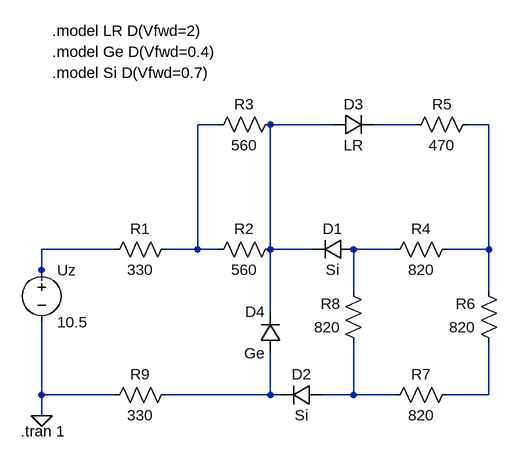
[diagram p0: schematic MajchrowskiMateusz.asc]
MajchrowskiMateusz.asc, the LTspice schematic file:
Version 4
SHEET 1 880 680
WIRE 144 -128 112 -128
WIRE 320 -128 224 -128
WIRE 448 -128 384 -128
WIRE 560 -128 528 -128
WIRE -16 64 -128 64
WIRE 112 64 112 -128
WIRE 112 64 64 64
WIRE 144 64 112 64
WIRE 224 64 224 -128
WIRE 288 64 224 64
WIRE 416 64 352 64
WIRE 560 64 560 -128
WIRE 560 64 496 64
WIRE -128 96 -128 64
WIRE -128 112 -128 96
WIRE 352 128 352 64
WIRE 560 128 560 64
WIRE 224 160 224 64
WIRE -128 288 -128 176
WIRE -16 288 -128 288
WIRE 224 288 224 224
WIRE 224 288 64 288
WIRE 240 288 224 288
WIRE 352 288 352 208
WIRE 352 288 304 288
WIRE 416 288 352 288
WIRE 560 288 560 208
WIRE 560 288 496 288
WIRE -128 320 -128 288
FLAG -128 320 0
SYMBOL voltage -128 80 R0
WINDOW 123 0 0 Left 2
WINDOW 39 0 0 Left 2
SYMATTR InstName Uz
SYMATTR Value 10.5
SYMBOL res 80 272 R90
WINDOW 0 0 56 VBottom 2
WINDOW 3 32 56 VTop 2
SYMATTR InstName R9
SYMATTR Value 330
SYMBOL res 368 224 R180
WINDOW 0 36 76 Left 2
WINDOW 3 36 40 Left 2
SYMATTR InstName R8
SYMATTR Value 820
SYMBOL res 576 224 R180
WINDOW 0 36 76 Left 2
WINDOW 3 36 40 Left 2
SYMATTR InstName R6
SYMATTR Value 820
SYMBOL res 512 272 R90
WINDOW 0 0 56 VBottom 2
WINDOW 3 32 56 VTop 2
SYMATTR InstName R7
SYMATTR Value 820
SYMBOL res 80 48 R90
WINDOW 0 0 56 VBottom 2
WINDOW 3 32 56 VTop 2
SYMATTR InstName R1
SYMATTR Value 330
SYMBOL res 240 48 R90
WINDOW 0 0 56 VBottom 2
WINDOW 3 32 56 VTop 2
SYMATTR InstName R2
SYMATTR Value 560
SYMBOL res 240 -144 R90
WINDOW 0 0 56 VBottom 2
WINDOW 3 32 56 VTop 2
SYMATTR InstName R3
SYMATTR Value 560
SYMBOL res 544 -144 R90
WINDOW 0 0 56 VBottom 2
WINDOW 3 32 56 VTop 2
SYMATTR InstName R5
SYMATTR Value 470
SYMBOL diode 240 224 R180
WINDOW 0 24 64 Left 2
WINDOW 3 24 0 Left 2
SYMATTR InstName D4
SYMATTR Value Ge
SYMBOL diode 352 48 R90
WINDOW 0 0 32 VBottom 2
WINDOW 3 32 32 VTop 2
SYMATTR InstName D1
SYMATTR Value Si
SYMBOL diode 320 -112 R270
WINDOW 0 32 32 VTop 2
WINDOW 3 0 32 VBottom 2
SYMATTR InstName D3
SYMATTR Value LR
SYMBOL diode 304 272 R90
WINDOW 0 0 32 VBottom 2
WINDOW 3 32 32 VTop 2
SYMATTR InstName D2
SYMATTR Value Si
SYMBOL res 512 48 R90
WINDOW 0 0 56 VBottom 2
WINDOW 3 32 56 VTop 2
SYMATTR InstName R4
SYMATTR Value 820
TEXT -112 -272 Left 2 !.model LR D(Vfwd=2)
TEXT -112 -240 Left 2 !.model Ge D(Vfwd=0.4)
TEXT -112 -208 Left 2 !.model Si D(Vfwd=0.7)
TEXT -160 344 Left 2 !.tran 1

The netlist it stands for:
* MajchrowskiMateusz.asc
V§Uz N005 0 10.5
R9 N007 0 330
R8 N008 N006 820
R6 N009 N004 820
R7 N009 N008 820
R1 N001 N005 330
R2 N002 N001 560
R3 N002 N001 560
R5 N004 N003 470
D4 N007 N002 Ge
D1 N006 N002 Si
D3 N002 N003 LR
D2 N008 N007 Si
R4 N004 N006 820
.model D D
.lib standard.dio
.model LR D(Vfwd=2)
.model Ge D(Vfwd=0.4)
.model Si D(Vfwd=0.7)
.tran 1
.backanno
.end